# Altium schematic sheet Power.SchDoc
size A4; SheetNumber: 10; SheetTotal: 12
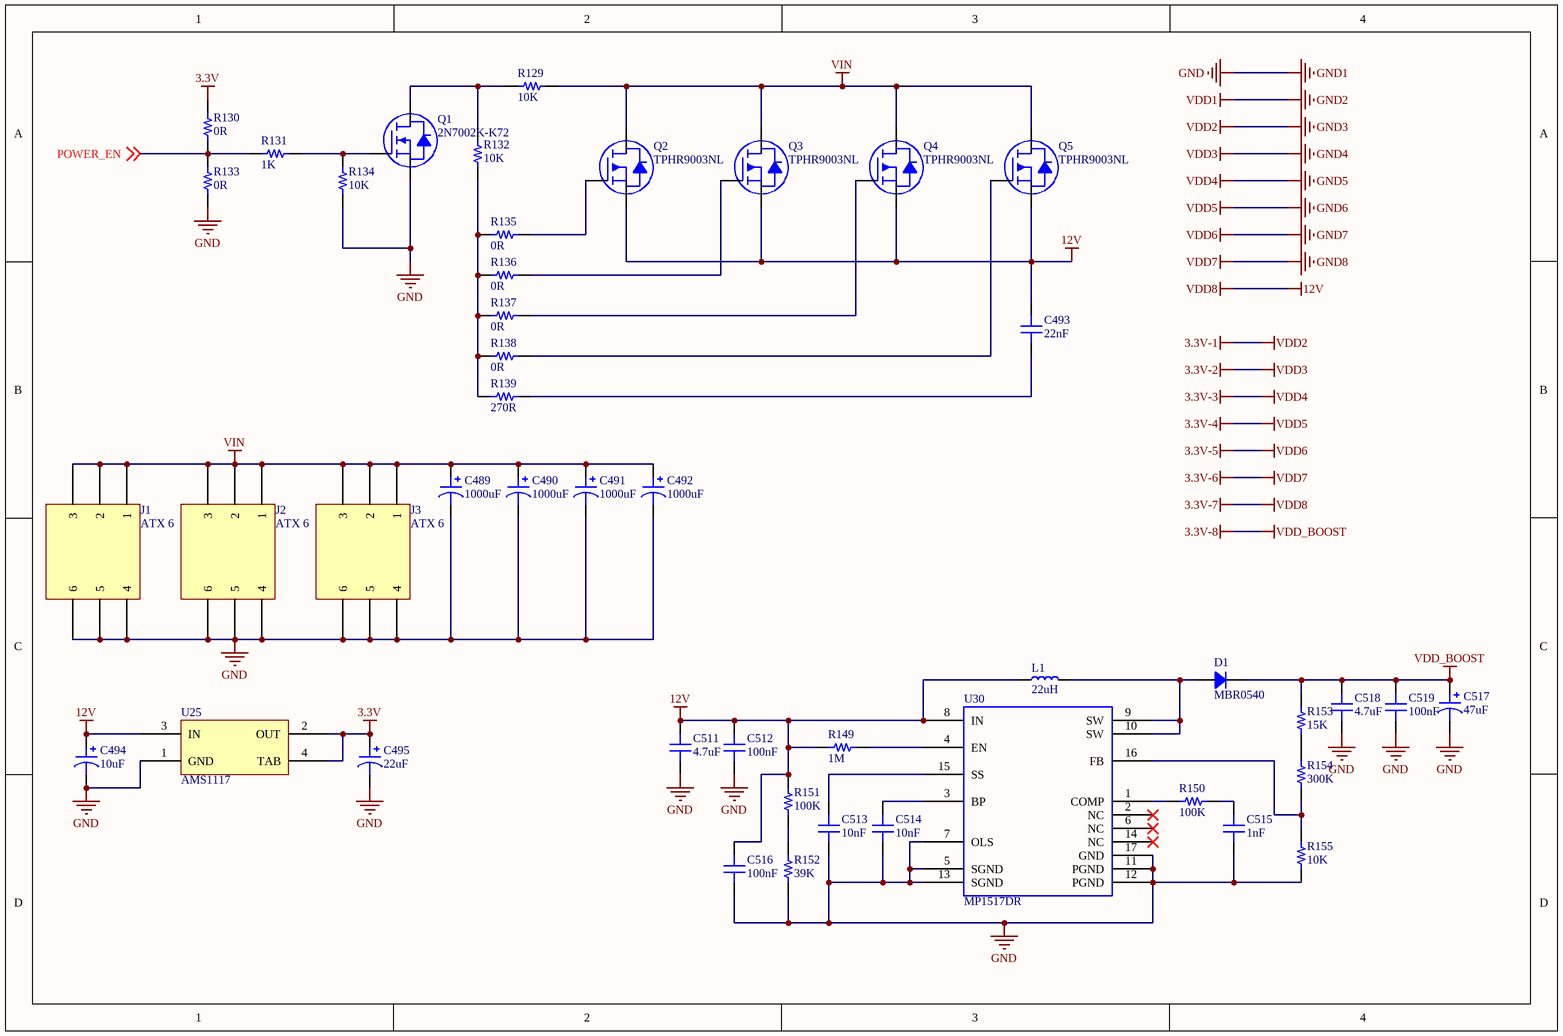
[diagram p0: Power.SchDoc]

## Parts
C489  1000uF  [CAP ALUM 10.3MM]
C490  1000uF  [CAP ALUM 10.3MM]
C491  1000uF  [CAP ALUM 10.3MM]
C492  1000uF  [CAP ALUM 10.3MM]
C493  22nF  [CAP_SMD_0805]
C494  10uF  [CAP-TAN-CASE-A]
C495  22uF  [CAP-TAN-CASE-A]
C511  4.7uF  [CAP_SMD_0805]
C512  100nF  [CAP_SMD_0805]
C513  10nF  [CAP_SMD_0805]
C514  10nF  [CAP_SMD_0805]
C515  1nF  [CAP_SMD_0805]
C516  100nF  [CAP_SMD_0805]
C517  47uF  [CAP ALUM 10.3MM]
C518  4.7uF  [CAP_SMD_0805]
C519  100nF  [CAP_SMD_0805]
D1  MBR0540  [m7]
J1  ATX 6  [ATX 6]
J2  ATX 6  [ATX 6]
J3  ATX 6  [ATX 6]
L1  22uH  [IND]
Q1  2N7002K-K72  [SOT-23_H]
Q2  TPHR9003NL  [ADVANCE SOP]
Q3  TPHR9003NL  [ADVANCE SOP]
Q4  TPHR9003NL  [ADVANCE SOP]
Q5  TPHR9003NL  [ADVANCE SOP]
R129  10K  [RES-SMD-1206]
R130  0R  [RES-SMD-1206]
R131  1K  [RES-SMD-1206]
R132  10K  [RES-SMD-1206]
R133  0R  [RES-SMD-1206]
R134  10K  [RES-SMD-1206]
R135  0R  [RES-SMD-1206]
R136  0R  [RES-SMD-1206]
R137  0R  [RES-SMD-1206]
R138  0R  [RES-SMD-1206]
R139  270R  [RES-SMD-1206]
R149  1M  [RES-SMD-1206]
R150  100K  [RES-SMD-1206]
R151  100K  [RES-SMD-1206]
R152  39K  [RES-SMD-1206]
R153  15K  [RES-SMD-1206]
R154  300K  [RES-SMD-1206]
R155  10K  [RES-SMD-1206]
U25  AMS1117  [AMS1117]
U30  MP1517DR  [QFN80P500X500X80-17N]

## Nets
3.3V: C495.1 R130.2 U25.2(OUT) U25.4(TAB)
3.3V-8: C517.1 C518.2 C519.2 D1.2 R153.1  [also labelled VDD_BOOST]
12V: C493.2 C494.1 C511.2 C512.2 C516.2 L1.1 Q2.D Q3.D Q4.D Q5.D R149.1 R151.2 U25.3(IN) U30.8(IN)  [also labelled 3.3V-7, VDD8]
GND: C489.2 C490.2 C491.2 C492.2 C494.2 C495.2 C511.1 C512.1 C513.1 C514.1 C515.1 C516.1 C517.2 C518.1 C519.1 J1.4 J1.5 J1.6 J2.4 J2.5 J2.6 J3.4 J3.5 J3.6 Q1.2 R133.1 R134.1 R152.1 R155.2 U25.1(GND) U30.5(SGND) U30.7(OLS) U30.11(PGND) U30.12(PGND) U30.13(SGND) U30.17(GND)  [also labelled GND1]
VIN: C489.1 C490.1 C491.1 C492.1 J1.1 J1.2 J1.3 J2.1 J2.2 J2.3 J3.1 J3.2 J3.3 Q2.S Q3.S Q4.S Q5.S R129.2
POWER_EN: R130.1 R131.2 R133.2 ; off-sheet POWER_EN
NetC493_1: C493.1 R139.2
NetC513_2: C513.2 U30.15(SS)
NetC514_2: C514.2 U30.3(BP)
NetC515_2: C515.2 R150.1
NetD1_1: D1.1 L1.2 U30.9(SW) U30.10(SW)
NetQ1_1: Q1.1 R131.1 R134.2
NetQ1_3: Q1.3 R129.1 R132.2
NetQ2_G: Q2.G R135.2
NetQ3_G: Q3.G R136.2
NetQ4_G: Q4.G R137.2
NetQ5_G: Q5.G R138.2
NetR132_1: R132.1 R135.1 R136.1 R137.1 R138.1 R139.1
NetR149_2: R149.2 U30.4(EN)
NetR150_2: R150.2 U30.1(COMP)
NetR151_1: R151.1 R152.2
NetR153_2: R153.2 R154.1
NetR154_2: R154.2 R155.1 U30.16(FB)

Not connected (* = marked no-connect by the designer): U30 2(NC)* 6(NC)* 14(NC)*

## Library data of the parts
C489-C492 C494 C495 C517 = POLARIZED CAP
C493 C511-C516 C518 C519 = CAP
D1 = 1N4007
L1 = INDUCTOR
Q1 = 2N70002
Q2-Q5 = MOSFET-N
R129-R139 R149-R155 = RES
U30 = MP1517